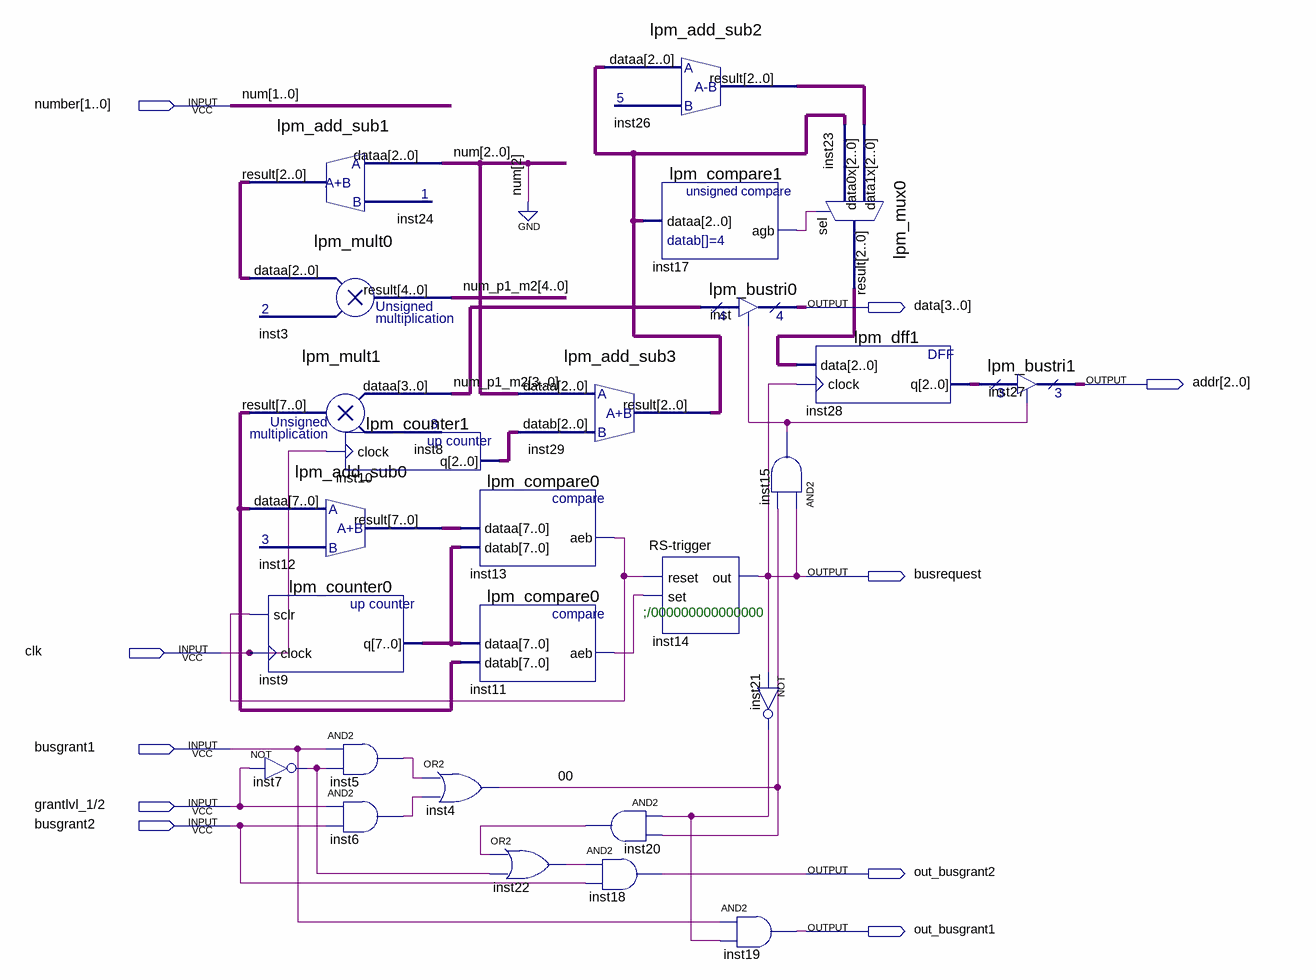
[diagram p0: schematic sheet]
// Quartus schematic master.bdf as structural Verilog: 26 symbols, 10 pins
module master (
  input  [1:0] number,
  input  clk,
  input  busgrant1,
  input  \grantlvl_1/2 ,
  input  busgrant2,
  output [3:0] data,
  output [2:0] addr,
  output busrequest,
  output out_busgrant2,
  output out_busgrant1
);

  wire \00 , inst5_out, inst6_out, inst7_out, inst11_aeb, inst13_aeb, inst15_out, inst17_agb, inst20_out,
       inst21_out, inst22_out;
  wire [2:0] inst10_q, inst23_result, inst24_result, inst26_result, inst28_q, inst29_result;
  wire [4:0] num_p1_m2;
  wire [7:0] inst8_result, inst9_q, inst12_result;

  lpm_add_sub1 inst24 (.dataa({1'b0, number}), .result(inst24_result));
  lpm_mult0 inst3 (.dataa(inst24_result), .result(num_p1_m2));
  lpm_mult1 inst8 (.dataa(num_p1_m2[3:0]), .result(inst8_result));
  lpm_add_sub0 inst12 (.dataa(inst8_result), .result(inst12_result));
  lpm_counter0 inst9 (.sclr(inst13_aeb), .clock(clk), .q(inst9_q));
  not inst7 (inst7_out, \grantlvl_1/2 );
  lpm_counter1 inst10 (.clock(clk), .q(inst10_q));
  and inst5 (inst5_out, busgrant1, inst7_out);
  and inst6 (inst6_out, \grantlvl_1/2 , busgrant2);
  lpm_compare0 inst13 (.dataa(inst12_result), .datab(inst9_q), .aeb(inst13_aeb));
  lpm_compare0 inst11 (.dataa(inst9_q), .datab(inst8_result), .aeb(inst11_aeb));
  or inst4 (\00 , inst5_out, inst6_out);
  or inst22 (inst22_out, inst20_out, inst7_out);
  lpm_add_sub3 inst29 (.dataa({1'b0, number}), .datab(inst10_q), .result(inst29_result));
  lpm_add_sub2 inst26 (.dataa(inst29_result), .result(inst26_result));
  lpm_compare1 inst17 (.dataa(inst29_result), .agb(inst17_agb));
  \RS-trigger  inst14 (.reset(inst13_aeb), .set(inst11_aeb), .out(busrequest));
  and inst20 (inst20_out, inst21_out, \00 );
  and inst18 (out_busgrant2, inst22_out, busgrant2);
  lpm_bustri0 inst (.enabledt(inst15_out), .data(num_p1_m2[3:0]), .tridata(data));
  and inst19 (out_busgrant1, busgrant1, inst21_out);
  lpm_dff1 inst28 (.data(inst23_result), .clock(busrequest), .q(inst28_q));
  and inst15 (inst15_out, busrequest, \00 );
  not inst21 (inst21_out, busrequest);
  lpm_mux0 inst23 (.data1x(inst26_result), .data0x(inst29_result), .sel(inst17_agb), .result(inst23_result));
  lpm_bustri1 inst27 (.enabledt(inst15_out), .data(inst28_q), .tridata(addr));

  // Other names for the same wires on the sheet: num[1:0] = number

  // Notes on the sheet:
  //   ;/000000000000000
endmodule
